# Altium schematic sheet PCA_0005_FULL_CB_Power_REV_B.SchDoc
size A4; DrawnBy: Philip Rowse
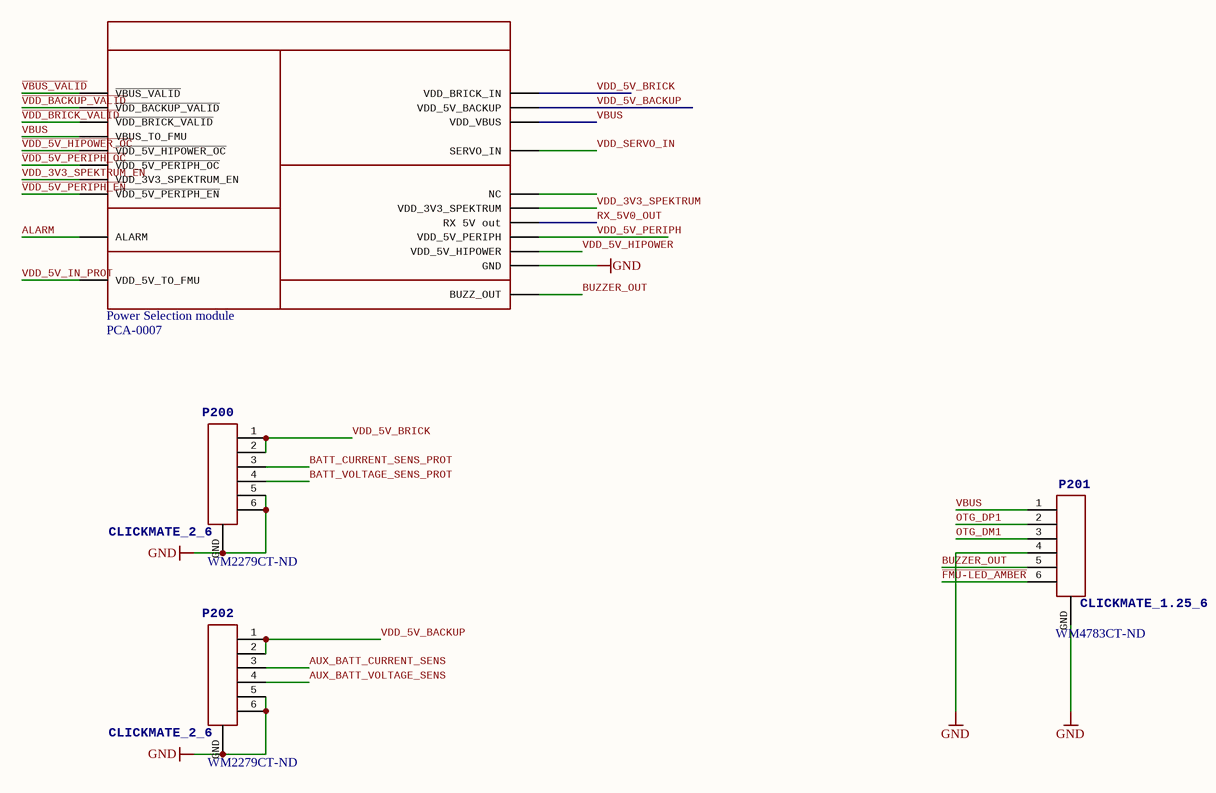
[diagram p0: PCA_0005_FULL_CB_Power_REV_B.SchDoc]

## Parts
P200  CLICKMATE_2_6  Supplier Part Number 1: WM2279CT-ND  [CLICKMATE_V6_2MM]
P201  CLICKMATE_1.25_6  Supplier Part Number 1: WM4783CT-ND  [CLICKMATE_V6]
P202  CLICKMATE_2_6  Supplier Part Number 1: WM2279CT-ND  [CLICKMATE_V6_2MM]
PSM200  Power Selection module  Supplier Part Number 1: PCA-0007  [PSM]

## Nets
GND: P200.5 P200.6 P200.GND P201.4 P201.GND P202.5 P202.6 P202.GND PSM200.GND
ALARM: PSM200.ALARM
AUX_BATT_CURRENT_SENS: P202.3
AUX_BATT_VOLTAGE_SENS: P202.4
BATT_CURRENT_SENS_PROT: P200.3
BATT_VOLTAGE_SENS_PROT: P200.4
BUZZER_OUT: P201.5 PSM200.BUZZER_OUT(BUZZ_OUT)
~{FMU-LED_AMBER}: P201.6
OTG_DM1: P201.3
OTG_DP1: P201.2
RX_5V0_OUT: PSM200.RX(RX_5V_out)
~{VBUS_VALID}: PSM200.!VBUS_VALID(~{VBUS_VALID})
~{VDD_5V_HIPOWER_OC}: PSM200.!VDD_5V_HIPOWER_OC(~{VDD_5V_HIPOWER_OC})
~{VDD_5V_PERIPH_EN}: PSM200.!VDD_5V_PERIPH_EN(~{VDD_5V_PERIPH_EN})
~{VDD_5V_PERIPH_OC}: PSM200.!VDD_5V_PERIPH_OC(~{VDD_5V_PERIPH_OC})
~{VDD_BACKUP_VALID}: PSM200.!VDD_BACKUP_VALID(~{VDD_BACKUP_VALID})
~{VDD_BRICK_VALID}: PSM200.!VDD_BRICK_VALID(~{VDD_BRICK_VALID})
VBUS: P201.1 PSM200.VBUS(VBUS_TO_FMU) PSM200.VDD_VBUS
VDD_3V3_SPEKTRUM: PSM200.SPEK(VDD_3V3_SPEKTRUM)
VDD_3V3_SPEKTRUM_EN: PSM200.VDD_3V3_SPEKTRUM_EN
VDD_5V_BACKUP: P202.1 P202.2 PSM200.VDD_5V_BACKUP
VDD_5V_BRICK: P200.1 P200.2 PSM200.VDD_BRICK_IN
VDD_5V_HIPOWER: PSM200.5V_HIPOWER(VDD_5V_HIPOWER)
VDD_5V_IN_PROT: PSM200.VDD_5V_IN_PROT(VDD_5V_TO_FMU)
VDD_5V_PERIPH: PSM200.5V_PERIPH(VDD_5V_PERIPH)
VDD_SERVO_IN: PSM200.SERVO_IN

Not connected (* = marked no-connect by the designer): PSM200 NC

## Notes on the sheet
- This licence Applies to this doccument ONLY, other components that make up the full system come with their own licences, please check with the Author for further information
- To the extent possible under law, Philip Rowse and 3DRobotics has waived all copyright and related or neighboring
- rights to the Carrier board. This work is published from: United States, and Australia
- Title:
- Date:
- Time:
- For information on this Licence: http://creativecommons.org/publicdomain/zero/1.0/
- Sheet:
- Approved:
- of:
- Drawn By:
- Checked By:
- 3DRobotics

## Library data of the parts
P200 P202 = CLICKMATE_2_6: Connector, Header, 6Pos, 2.54MM, Vert, THT, Au; 3DR_PARTNO: PRT0445; Supplier 1: Digi-Key
P201 = CLICKMATE_1.25_6: Connector, Rcpt, 6Pos, 1.25MM, W/B, VERT, SMD, Tin; 3DR_PARTNO: PRT0439; Supplier 1: Digi-Key
PSM200 = PSMPSM: PCA, PSM, PX4, Assembly; Manufacturer 1: 3DR; Mfg Part Num (Alternate): DO NOT SWAP; 3DR_PARTNO: PCA0007; Supplier 1: 3DR; Supplier Unit Price 1: 17; Manufacturer Part Number 1: PCA-0007; Supplier Currency 1: USD; Supplier Order Qty 1: 100